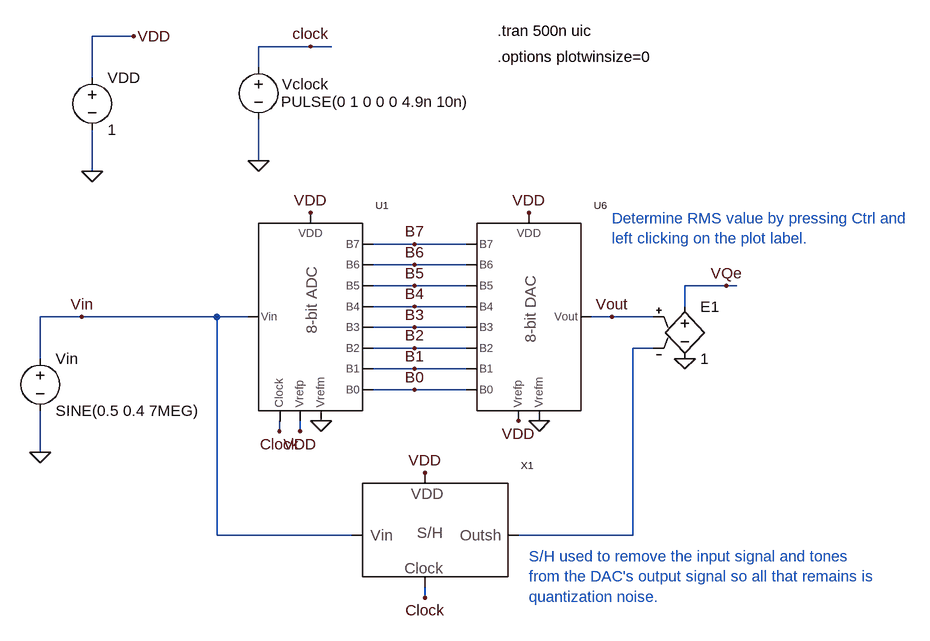
[diagram p0: schematic _Fig5_13_MSD.asc]
_Fig5_13_MSD.asc, the LTspice schematic file:
Version 4
SHEET 1 2740 696
WIRE 592 -816 528 -816
WIRE 864 -800 784 -800
WIRE 896 -800 864 -800
WIRE 784 -768 784 -800
WIRE 528 -752 528 -816
WIRE 784 -624 784 -688
WIRE 528 -608 528 -672
WIRE 1024 -496 960 -496
WIRE 1104 -496 1024 -496
WIRE 1024 -464 960 -464
WIRE 1104 -464 1024 -464
WIRE 1024 -432 960 -432
WIRE 1104 -432 1024 -432
WIRE 1504 -432 1440 -432
WIRE 1520 -432 1504 -432
WIRE 1024 -400 960 -400
WIRE 1104 -400 1024 -400
WIRE 1440 -400 1440 -432
WIRE 512 -384 448 -384
WIRE 720 -384 512 -384
WIRE 768 -384 720 -384
WIRE 1328 -384 1296 -384
WIRE 1392 -384 1328 -384
WIRE 1024 -368 960 -368
WIRE 1104 -368 1024 -368
WIRE 1024 -336 960 -336
WIRE 1104 -336 1024 -336
WIRE 1392 -336 1360 -336
WIRE 448 -320 448 -384
WIRE 1024 -304 960 -304
WIRE 1104 -304 1024 -304
WIRE 1024 -272 960 -272
WIRE 1104 -272 1024 -272
WIRE 816 -208 816 -224
WIRE 848 -208 848 -224
WIRE 448 -176 448 -240
WIRE 720 -48 720 -384
WIRE 928 -48 720 -48
WIRE 1360 -48 1360 -336
WIRE 1360 -48 1184 -48
WIRE 1040 48 1040 32
FLAG 448 -176 0
FLAG 512 -384 Vin
FLAG 784 -624 0
FLAG 864 -800 clock
FLAG 528 -608 0
FLAG 592 -816 VDD
FLAG 1328 -384 Vout
FLAG 1184 -224 VDD
FLAG 1216 -224 0
FLAG 1024 -496 B7
FLAG 1024 -464 B6
FLAG 1024 -432 B5
FLAG 1024 -400 B4
FLAG 1024 -368 B3
FLAG 1024 -336 B2
FLAG 1024 -304 B1
FLAG 1024 -272 B0
FLAG 1200 -544 VDD
FLAG 864 -544 VDD
FLAG 880 -224 0
FLAG 816 -208 Clock
FLAG 848 -208 VDD
FLAG 1440 -320 0
FLAG 1504 -432 VQe
FLAG 1040 -144 VDD
FLAG 1040 48 Clock
SYMBOL voltage 448 -336 R0
WINDOW 123 0 0 Left 0
WINDOW 39 0 0 Left 0
SYMATTR InstName Vin
SYMATTR Value SINE(0.5 0.4 7MEG)
SYMBOL voltage 784 -784 R0
WINDOW 0 36 42 Left 0
WINDOW 3 35 69 Left 0
WINDOW 123 0 0 Left 0
WINDOW 39 0 0 Left 0
SYMATTR InstName Vclock
SYMATTR Value PULSE(0 1 0 0 0 4.9n 10n)
SYMBOL voltage 528 -768 R0
WINDOW 123 0 0 Left 0
WINDOW 39 0 0 Left 0
SYMATTR InstName VDD
SYMATTR Value 1
SYMBOL Ideal_8_bit_DAC 1120 -240 R0
SYMATTR InstName U6
SYMBOL Ideal_8_bit_ADC 784 -240 R0
SYMATTR InstName U1
SYMBOL e 1440 -416 R0
SYMATTR InstName E1
SYMATTR Value 1
SYMBOL Sample_and_hold 944 16 R0
SYMATTR InstName X1
TEXT 1152 -824 Left 0 !.tran 500n uic
TEXT 1152 -784 Left 0 !.options plotwinsize=0
TEXT 1200 -16 Left 0 ;S/H used to remove the input signal and tones\nfrom the DAC's output signal so all that remains is\nquantization noise.
TEXT 1328 -536 Left 0 ;Determine RMS value by pressing Ctrl and\nleft clicking on the plot label.

The netlist it stands for:
* _Fig5_13_MSD.asc
Vin Vin 0 SINE(0.5 0.4 7MEG)
Vclock clock 0 PULSE(0 1 0 0 0 4.9n 10n)
VDD VDD 0 1
XU6 B7 B6 B5 B4 B3 B2 B1 B0 Vout VDD 0 VDD Ideal_8_bit_DAC  ; pins B7 B6 B5 B4 B3 B2 B1 B0 Vout Vrefp Vrefm VDD
XU1 B7 B6 B5 B4 B3 B2 B1 B0 Vin VDD 0 clock VDD Ideal_8_bit_ADC  ; pins B7 B6 B5 B4 B3 B2 B1 B0 Vin Vrefp Vrefm Clock VDD
E1 VQe 0 Vout N001 1
XX1 Vin N001 clock VDD Sample_and_hold  ; pins Vin Outsh Clock VDD
.tran 500n uic
.options plotwinsize=0
* S/H used to remove the input signal and tones
* from the DAC's output signal so all that remains is
* quantization noise.
* Determine RMS value by pressing Ctrl and
* left clicking on the plot label.
.backanno
.end